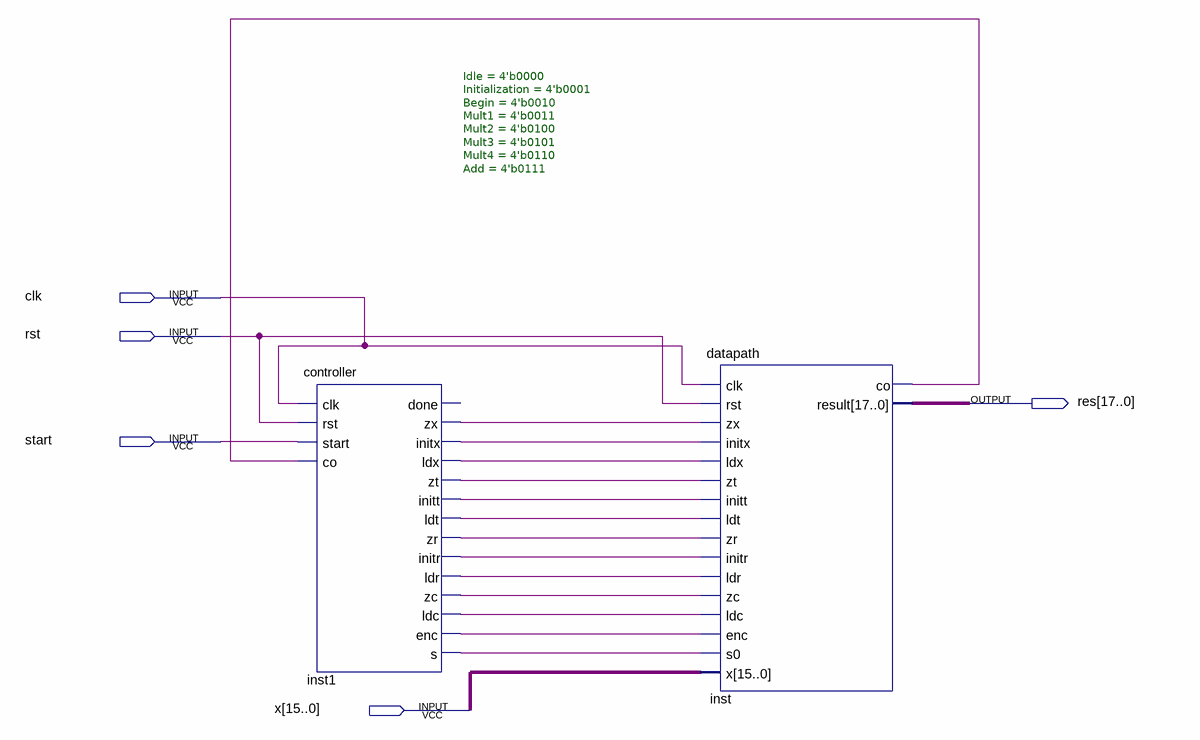
[diagram p0: schematic sheet]
// Quartus schematic Block2.bdf as structural Verilog: 2 symbols, 5 pins
module Block2 (
  input  clk,
  input  rst,
  input  start,
  input  [15:0] x,
  output [17:0] res
);

  wire inst1_enc, inst1_initr, inst1_initt, inst1_initx, inst1_ldc, inst1_ldr, inst1_ldt, inst1_ldx, inst1_s,
       inst1_zc, inst1_zr, inst1_zt, inst1_zx, inst_co;

  controller #(.Idle(4'b0000), .Initialization(4'b0001), .Begin(4'b0010), .Mult1(4'b0011), .Mult2(4'b0100), .Mult3(4'b0101), .Mult4(4'b0110), .Add(4'b0111)) inst1 (
    .clk(clk), .rst(rst), .start(start), .co(inst_co), .zx(inst1_zx), .initx(inst1_initx), .ldx(inst1_ldx),
    .zt(inst1_zt), .initt(inst1_initt), .ldt(inst1_ldt), .zr(inst1_zr), .initr(inst1_initr), .ldr(inst1_ldr),
    .zc(inst1_zc), .ldc(inst1_ldc), .enc(inst1_enc), .s(inst1_s));  // open: done
  datapath inst (
    .clk(clk), .rst(rst), .zx(inst1_zx), .initx(inst1_initx), .ldx(inst1_ldx), .zt(inst1_zt),
    .initt(inst1_initt), .ldt(inst1_ldt), .zr(inst1_zr), .initr(inst1_initr), .ldr(inst1_ldr), .zc(inst1_zc),
    .ldc(inst1_ldc), .enc(inst1_enc), .s0(inst1_s), .x(x), .co(inst_co), .result(res));
endmodule
